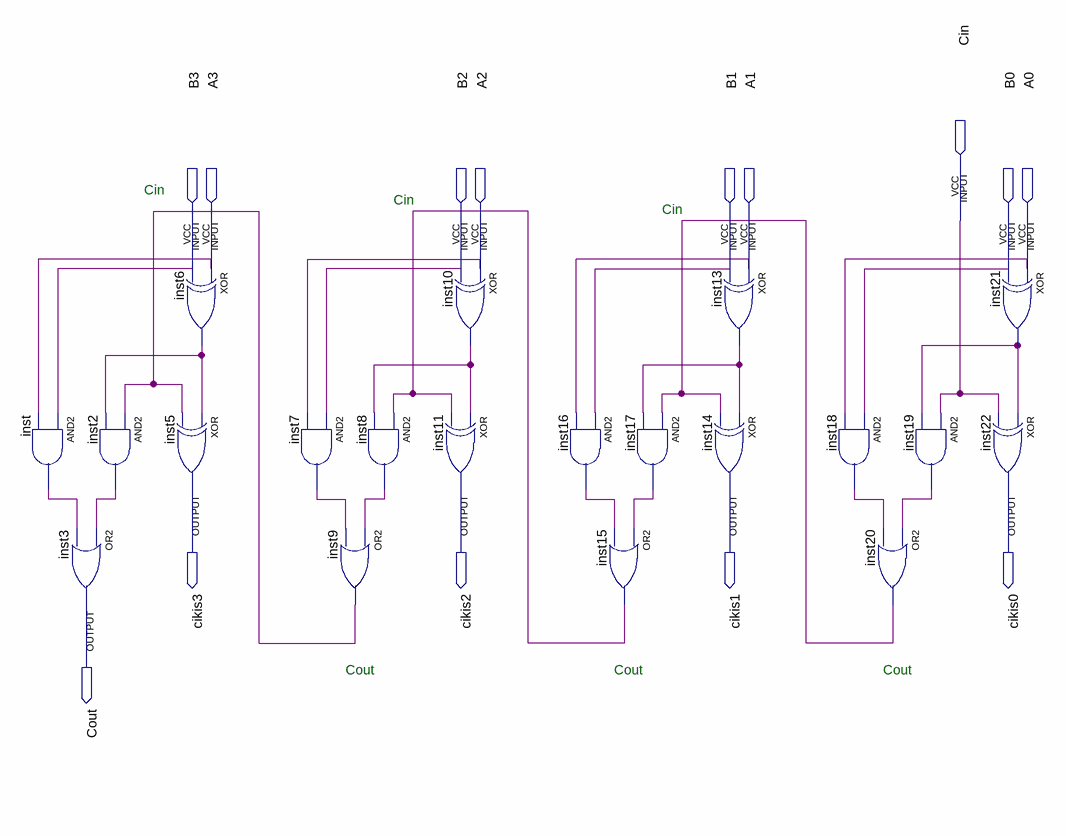
[diagram p0: schematic sheet]
// Quartus schematic toplayici.bdf as structural Verilog: 20 symbols, 14 pins
module toplayici (
  input  Cin,
  input  B3,
  input  A3,
  input  B2,
  input  A2,
  input  B1,
  input  A1,
  input  B0,
  input  A0,
  output cikis3,
  output cikis2,
  output cikis1,
  output cikis0,
  output Cout
);

  wire inst2_out, inst6_out, inst7_out, inst8_out, inst9_out, inst10_out, inst13_out, inst15_out, inst16_out,
       inst17_out, inst18_out, inst19_out, inst20_out, inst21_out, inst_out;

  and inst (inst_out, B3, A3);
  or inst3 (Cout, inst2_out, inst_out);
  and inst2 (inst2_out, inst9_out, inst6_out);
  xor inst6 (inst6_out, A3, B3);
  xor inst5 (cikis3, inst6_out, inst9_out);
  and inst7 (inst7_out, B2, A2);
  and inst8 (inst8_out, inst15_out, inst10_out);
  or inst9 (inst9_out, inst8_out, inst7_out);
  xor inst10 (inst10_out, A2, B2);
  xor inst11 (cikis2, inst10_out, inst15_out);
  and inst16 (inst16_out, B1, A1);
  or inst15 (inst15_out, inst17_out, inst16_out);
  and inst17 (inst17_out, inst20_out, inst13_out);
  xor inst13 (inst13_out, A1, B1);
  xor inst14 (cikis1, inst13_out, inst20_out);
  and inst18 (inst18_out, B0, A0);
  and inst19 (inst19_out, Cin, inst21_out);
  or inst20 (inst20_out, inst19_out, inst18_out);
  xor inst22 (cikis0, inst21_out, Cin);
  xor inst21 (inst21_out, A0, B0);

  // Notes on the sheet:
  //   Cin
  //   Cin
  //   Cin
  //   Cout
  //   Cout
  //   Cout
endmodule
